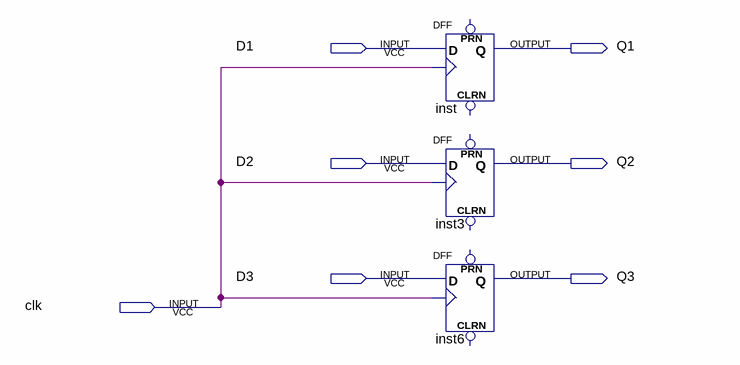
[diagram p0: schematic sheet]
// Quartus schematic DFF_3.bdf as structural Verilog: 3 symbols, 7 pins
module DFF_3 (
  input  D1,
  input  D2,
  input  D3,
  input  clk,
  output Q1,
  output Q2,
  output Q3
);

  DFF inst (.CLK(clk), .D(D1), .Q(Q1));  // open: CLRN, PRN
  DFF inst3 (.CLK(clk), .D(D2), .Q(Q2));  // open: CLRN, PRN
  DFF inst6 (.CLK(clk), .D(D3), .Q(Q3));  // open: CLRN, PRN
endmodule
